# Altium schematic sheet EUP3489.SchDoc
size A1
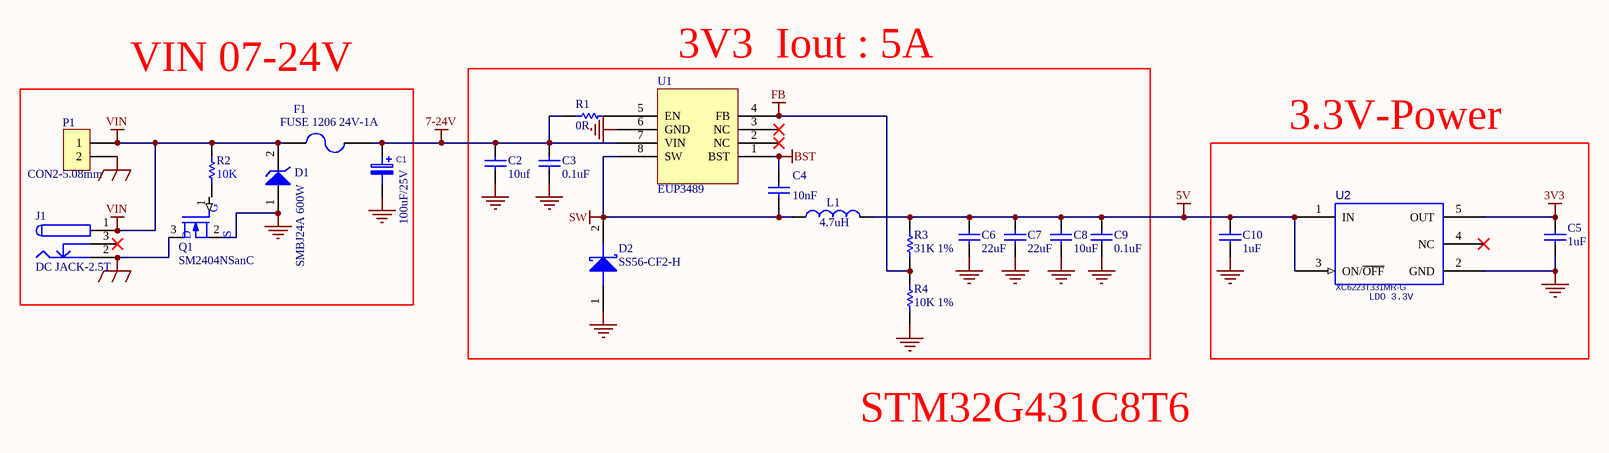
[diagram p0: EUP3489.SchDoc]

## Parts
C1  100uF/25V  [DIP CAP-8*3.5]
C2  10uf  [0603C]
C3  0.1uF  [0603C]
C4  10nF  [0603C]
C5  1uF  [0603C]
C6  22uF  [0805C]
C7  22uF  [0805C]
C8  10uF  [0603C]
C9  0.1uF  [0603C]
C10  1uF  [0603C]
D1  SMBJ24A 600W  [SMBJ40CA(TVS)]
D2  SS56-CF2-H  [SS56-CF2-H]
F1  FUSE 1206 24V-1A  [1206-FUSE]
J1  DC JACK-2.5T  [DC JACK-2.5T-NEW]
L1  4.7uH  [L7X6.6]
P1  CON2-5.08mm  [OQ5.08-90D-2P]
Q1  SM2404NSanC  [SOT-23]
R1  0R  [0603]
R2  10K  [0603]
R3  31K 1%  [0603]
R4  10K 1%  [0603]
U1  EUP3489  [MOS SOP8]
U2  XC6223T331MR-G  [SOT-23-5-0.95MM]

## Blocks framed on the sheet
3V3  Iout : 5A: C2-C4 C6-C9 D2 L1 R1 R3 R4 U1
VIN 07-24V: C1 D1 F1 J1 P1 Q1 R2
3.3V-Power: C5 C10 U2

## Nets
3V3: C5.2 U2.5(OUT)
5V: C6.2 C7.2 C8.2 C9.2 C10.2 L1.2 R3.2 U2.1(IN) U2.3(ON/~{OFF})
7-24V: C1.1 C2.2 C3.2 F1.2 R1.1 U1.7(VIN)
BST: C4.1 U1.1(BST)
FB: R3.1 R4.2 U1.4(FB)
GND: C1.2 C2.1 C3.1 C5.1 C6.1 C7.1 C8.1 C9.1 C10.1 D1.1 D2.1 Q1.2(SOURCE) R4.1 U1.6(GND) U2.2(GND)
PGND: J1.2 P1.2 Q1.3(DRAIN)
SW: C4.2 D2.2 L1.1 U1.8(SW)
VIN: D1.2 F1.1 J1.1 P1.1 R2.2
NetR1_2: R1.2 U1.5(EN)

Not connected (* = marked no-connect by the designer): J1 3*; Q1 1(GATE); R2 1; U1 2(NC)* 3(NC)*; U2 4(NC)*

## Notes on the sheet
- (near U2) LDO 3.3V
- STM32G431C8T6
- (in symbol MOSFET N-1) G; D; S

## Library data of the parts
C1 = C POL: Part Number: 53300833000; Right: 20; Tolerance: 20%; Rating: 10V; Package Height: 1.8mm; PCB_x: 19.129500; PCB_y: 12.184000; PCB_dir: 0.000000; PCB_loc: Top; Bottom: 20; Value: 100uF/25V
C2 C6-C9 = Cap Semi: Capacitor
  C2: Published: 8-Jun-2000; LatestRevisionDate: 17-Jul-2002; LatestRevisionNote: Re-released for DXP Platform.; PackageReference: C1206; Publisher: Altium Limited; Value: 10uf
  C6 C7: Value: 22uF
  C8: Value: 10uF
  C9: Value: 0.1uF
C3-C5 C10 = Cap Semi: Capacitor (Semiconductor SIM Model); Published: 8-Jun-2000; LatestRevisionDate: 17-Jul-2002; LatestRevisionNote: Re-released for DXP Platform.; PackageReference: C1206; Publisher: Altium Limited
  C3: Value: 0.1uF
  C4: Value: 10nF
  C5 C10: Value: 1uF
D1 = PESD5V0L1BA: Zener Diode; Value: SMBJ24A 600W
D2 = DIODE SCHOTTKY: Schottky Diode; Value: SS56-CF2-H
F1 = FUSE2: Fuse; Value: FUSE 1206 24V-1A
J1 = DCJACK-1: Low Voltage Power Supply Connector; Published: *; DatasheetDocument: *; Publisher: *; ComponentLink1Description: *; ComponentLink1URL: *; Value: DC JACK-2.5T
L1 = Inductor: Code_IEC: 1005; Published: 8-Jun-2000; LatestRevisionDate: 17-Jul-2002; LatestRevisionNote: Re-released for DXP Platform.; PackageReference: 0402-A; Publisher: Altium Limited; Code_JEITA: 0402; Value: 4.7uH
P1 = CON2: Connector; Value: CON2-5.08mm
Q1 = MOSFET N-1: N-Channel Mosfet; Value: SM2404NSanC
R1-R4 = Res Semi: Semiconductor Resistor; Published: 8-Jun-2000; LatestRevisionDate: 17-Jul-2002; LatestRevisionNote: Re-released for DXP Platform.; PackageReference: AXIAL-0.5; Publisher: Altium Limited
  R1: Value: 0R
  R2: Value: 10K
  R3: Value: 31K 1%
  R4: Value: 10K 1%
U1 = EUP3489: DC-DC  Buck 5A,30V; Value: EUP3489
U2 = XC6223T331MR-G: Value: XC6223T331MR-G